# EAGLE schematic RFX10MQTT (EAGLE 7.3.0)
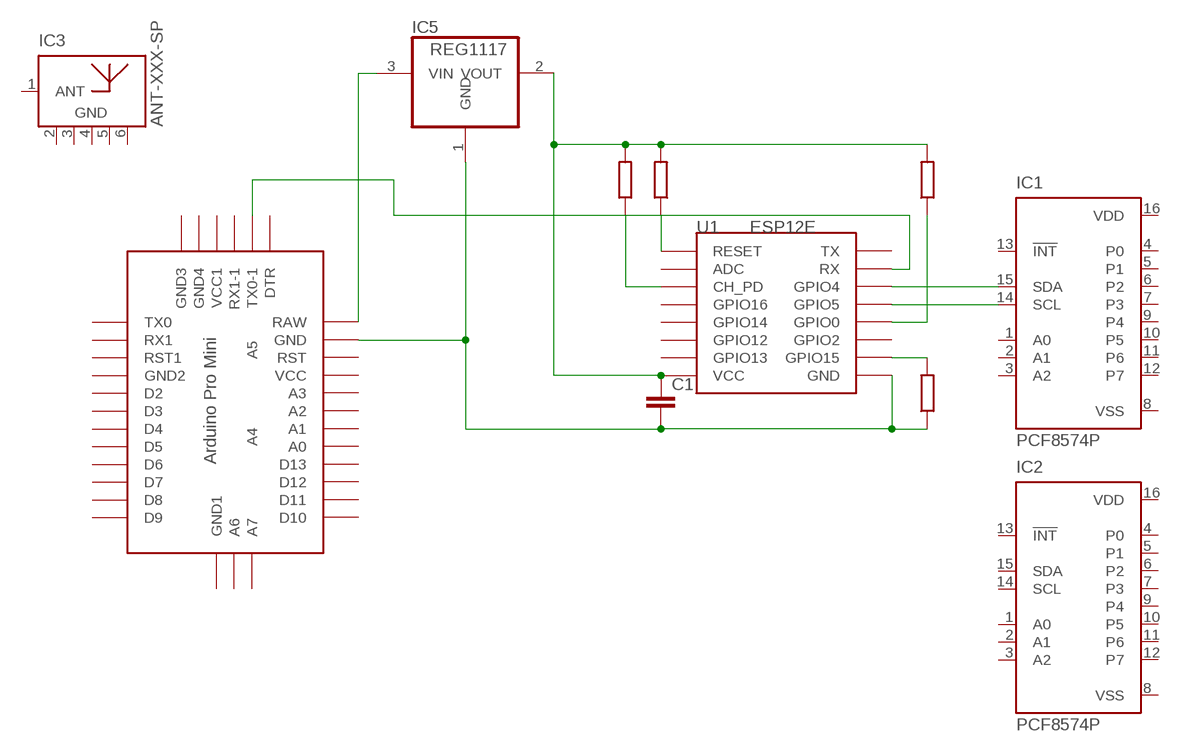
[diagram p0: schematic, sheet 1]

## Parts
C1  C2,5-3  [C2.5-3]
IC1  PCF8574P  [DIL16]
IC2  PCF8574P  [DIL16]
IC3  ANT-XXX-SP  [ANT-XXX-SP]
IC5  REG1117  [SOT223]
U1  ESP12  [ESP12]
U$1  ABK-PRO-MINI  [ABK-PRO-MINI]

## Nets
ESP12E: U1.RX U$1.TX0-1
N$1: IC1.15(SDA) U1.GPIO4
N$2: IC1.14(SCL) U1.GPIO5
N$3: U1.GPIO15
N$4: C1.2 IC5.1(GND) U1.GND U$1.GND
N$5: U1.RESET
N$6: U1.CH_PD
N$7: U1.GPIO0
N$9: C1.1 IC5.2(VOUT) U1.VCC
N$11: IC5.3(VIN) U$1.RAW
Unconnected: IC1.1(A0) IC1.2(A1) IC1.3(A2) IC1.4(P0) IC1.5(P1) IC1.6(P2) IC1.7(P3) IC1.9(P4) IC1.10(P5) IC1.11(P6) IC1.12(P7) IC1.13(!INT) IC2.1(A0) IC2.2(A1) IC2.3(A2) IC2.4(P0) IC2.5(P1) IC2.6(P2) IC2.7(P3) IC2.9(P4) IC2.10(P5) IC2.11(P6) IC2.12(P7) IC2.13(!INT) IC2.14(SCL) IC2.15(SDA) IC3.1(ANT) IC3.2(GND) IC3.3(GND) IC3.4(GND) IC3.5(GND) IC3.6(GND) U1.ADC U1.GPIO2 U1.GPIO12 U1.GPIO13 U1.GPIO14 U1.GPIO16 U1.TX U$1.A0 U$1.A1 U$1.A2 U$1.A3 U$1.A4 U$1.A5 U$1.A6 U$1.A7 U$1.D2 U$1.D3 U$1.D4 U$1.D5 U$1.D6 U$1.D7 U$1.D8 U$1.D9 U$1.D10 U$1.D11 U$1.D12 U$1.D13 U$1.DTR U$1.GND1(GND2) U$1.GND2(GND3) U$1.GND3(GND4) U$1.GND4(GND1) U$1.RST U$1.RST1 U$1.RX1 U$1.RX1-1 U$1.TX0 U$1.VCC U$1.VCC1

## Power pins joined to a net without a drawn wire
VDD: IC1.16(VDD) IC2.16(VDD)
VSS: IC1.8(VSS) IC2.8(VSS)

## Library data of the parts
C1 = capacitor-wima:C: CAPACITOR naming: grid - package width
IC1 IC2 = micro-philips:PCF8574: I2C-Bus Remote 8-bit I/O expander http://www.semiconductors.philips.com/acrobat_download/datasheets/PCF8574_4.pdf; MPN: PCF8574PN; OC_FARNELL: 204020; OC_NEWARK: 11N8515
IC3 = linx:ANT-XXX-SP: ANT-315-SP Source: http://www.antennafactor.com/documents/ANT-315-SP_Data_Sheet.pdf; OC_FARNELL: unknown; OC_NEWARK: unknown
IC5 = burr-brown:REG1117: 800mA and 1A Low Dropout (LDO) Positive Regulator 1.8V, 2.5V, 2.85V, 3.3V, 5V, and Adj; MPN: REG1117; OC_FARNELL: 1097566; OC_NEWARK: 14P6981
U1 = esp8266modules:ESP12: ESP8266 Wifi module 12
U$1 = Arduino-clone:ABK-PRO-MINI: ABK Pro-Mini Arduino Clone